# Altium schematic sheet CW340_Block_Diagram.SchDoc: Block Diagram
size Letter; SheetNumber: 2; SheetTotal: 31
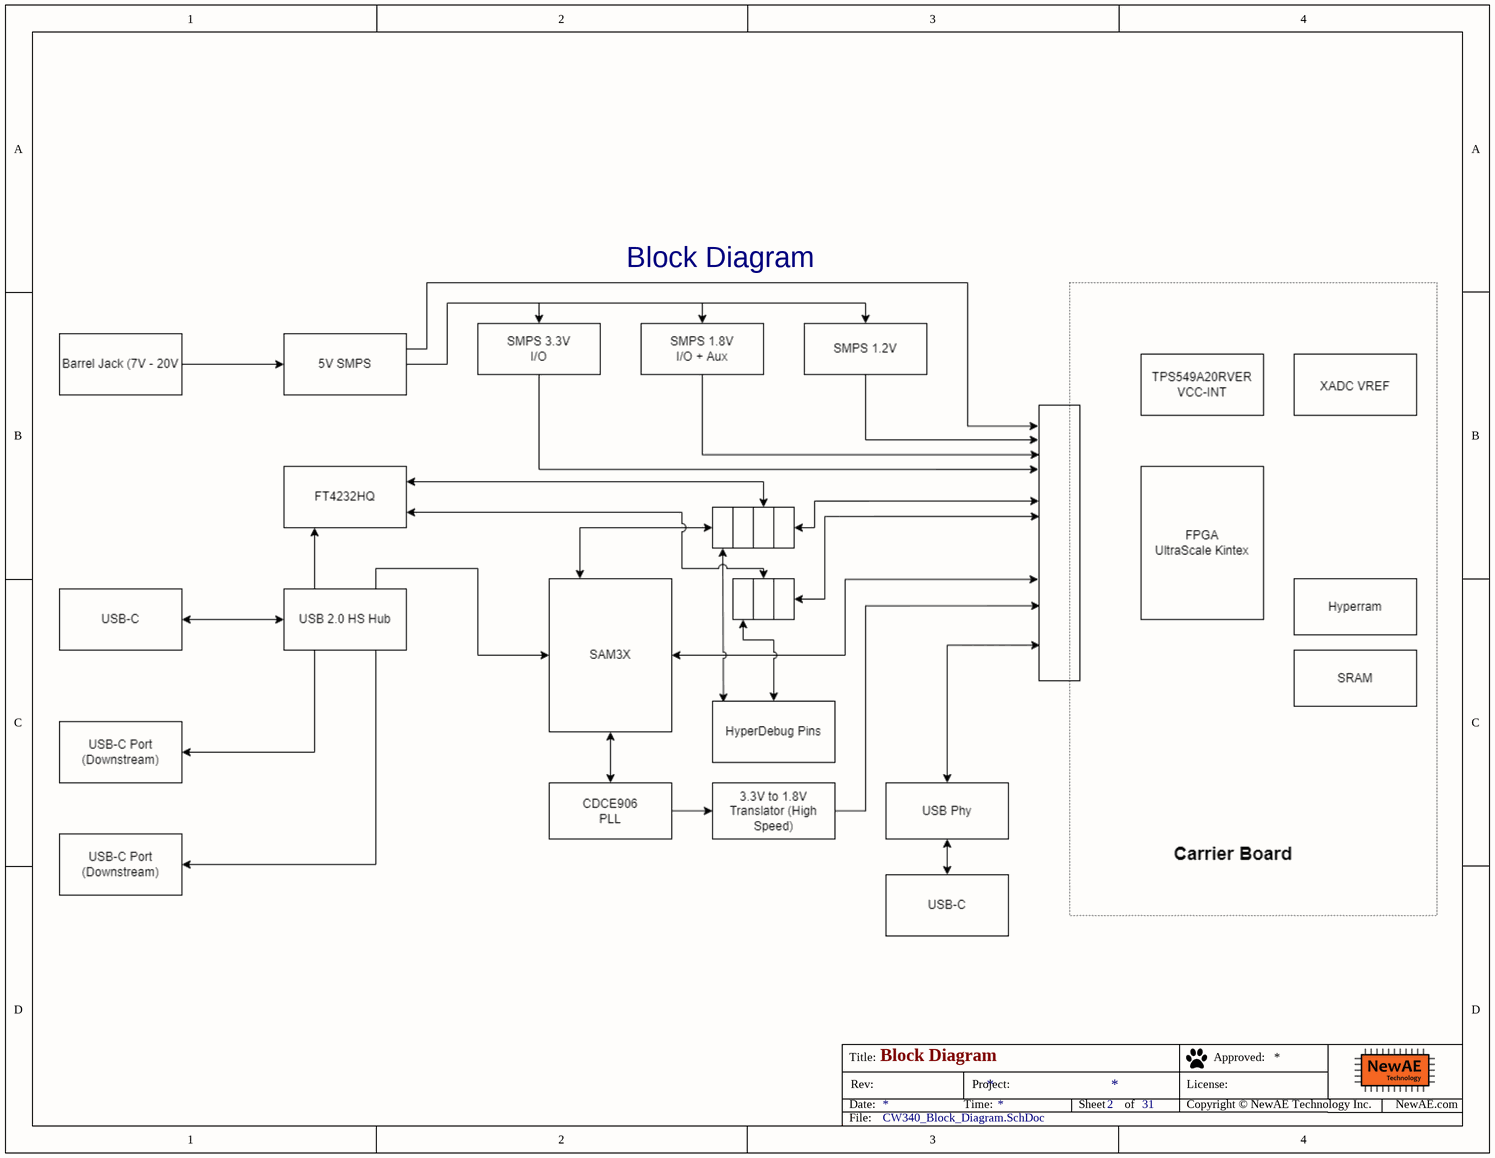
[diagram p0: CW340_Block_Diagram.SchDoc]

## Notes on the sheet
- Block Diagram
- Title:
- Date:
- Rev:
- Time:
- Project:
- Sheet
- of
- License:
- Copyright © NewAE Technology Inc.
- Approved:
- NewAE.com
- File: